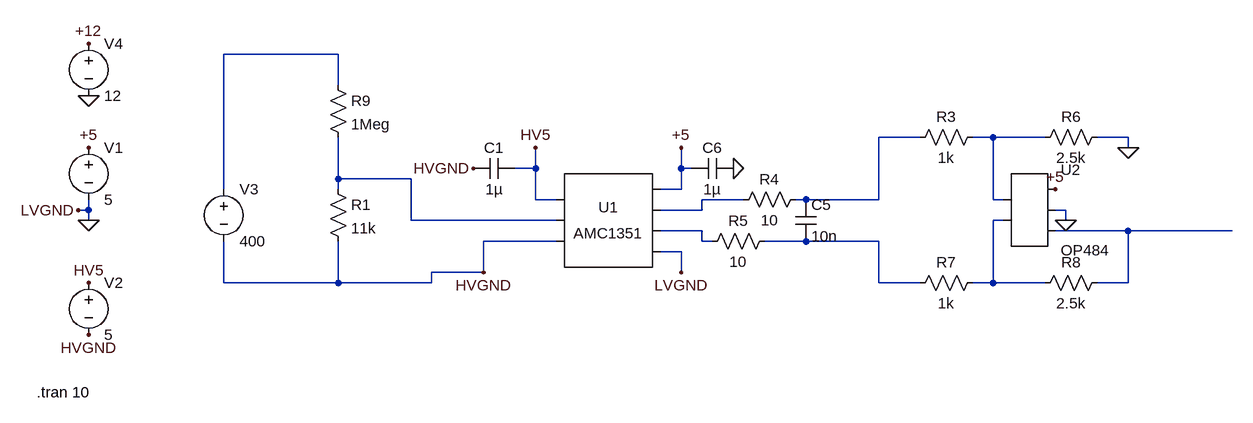
[diagram p0: schematic AMC1350Test.asc]
AMC1350Test.asc, the LTspice schematic file:
Version 4
SHEET 1 1220 680
WIRE -160 -80 -336 -80
WIRE -160 -32 -160 -80
WIRE 736 48 672 48
WIRE 848 48 816 48
WIRE 928 48 848 48
WIRE 1056 48 1008 48
WIRE 1056 64 1056 48
WIRE 144 96 144 64
WIRE 144 96 112 96
WIRE 368 96 368 64
WIRE 384 96 368 96
WIRE -160 112 -160 48
WIRE -48 112 -160 112
WIRE -336 128 -336 -80
WIRE -160 128 -160 112
WIRE 368 128 368 96
WIRE 368 128 336 128
WIRE 144 144 144 96
WIRE 176 144 144 144
WIRE 464 144 400 144
WIRE 560 144 544 144
WIRE 672 144 672 48
WIRE 672 144 560 144
WIRE 848 144 848 48
WIRE 864 144 848 144
WIRE -544 160 -544 144
WIRE -544 160 -560 160
WIRE 400 160 400 144
WIRE 400 160 336 160
WIRE 960 160 944 160
WIRE -544 176 -544 160
WIRE -48 176 -48 112
WIRE 176 176 -48 176
WIRE 864 176 848 176
WIRE 960 176 960 160
WIRE 400 192 336 192
WIRE 1056 192 944 192
WIRE 1216 192 1056 192
WIRE 176 208 64 208
WIRE 400 208 400 192
WIRE 416 208 400 208
WIRE 560 208 496 208
WIRE 672 208 560 208
WIRE 368 224 336 224
WIRE 64 256 64 208
WIRE 64 256 -16 256
WIRE 368 256 368 224
WIRE -336 272 -336 208
WIRE -160 272 -160 208
WIRE -160 272 -336 272
WIRE -16 272 -16 256
WIRE -16 272 -160 272
WIRE 672 272 672 208
WIRE 736 272 672 272
WIRE 848 272 848 176
WIRE 848 272 816 272
WIRE 928 272 848 272
WIRE 1056 272 1056 192
WIRE 1056 272 1008 272
FLAG 368 64 +5
FLAG 144 64 HV5
FLAG 368 256 LVGND
FLAG 64 256 HVGND
FLAG -544 176 0
FLAG -560 160 LVGND
FLAG -544 352 HVGND
FLAG -544 272 HV5
FLAG -544 64 +5
FLAG 448 96 0
FLAG 48 96 HVGND
FLAG 1056 64 0
FLAG -544 -16 0
FLAG -544 -96 +12
FLAG 960 176 0
FLAG 944 128 +5
SYMBOL cap 112 80 R90
WINDOW 0 0 32 VBottom 2
WINDOW 3 32 32 VTop 2
SYMATTR InstName C1
SYMATTR Value 1µ
SYMBOL res -176 112 R0
SYMATTR InstName R1
SYMATTR Value 11k
SYMBOL cap 544 144 R0
SYMATTR InstName C5
SYMATTR Value 10n
SYMBOL res 512 192 R90
WINDOW 0 0 56 VBottom 2
WINDOW 3 32 56 VTop 2
SYMATTR InstName R5
SYMATTR Value 10
SYMBOL res 560 128 R90
WINDOW 0 0 56 VBottom 2
WINDOW 3 32 56 VTop 2
SYMATTR InstName R4
SYMATTR Value 10
SYMBOL cap 448 80 R90
WINDOW 0 0 32 VBottom 2
WINDOW 3 32 32 VTop 2
SYMATTR InstName C6
SYMATTR Value 1µ
SYMBOL voltage -544 48 R0
WINDOW 123 24 114 Left 2
WINDOW 39 0 0 Left 0
SYMATTR InstName V1
SYMATTR Value 5
SYMBOL voltage -544 256 R0
WINDOW 123 24 114 Left 2
WINDOW 39 0 0 Left 0
SYMATTR InstName V2
SYMATTR Value 5
SYMBOL voltage -336 112 R0
WINDOW 123 0 0 Left 0
WINDOW 39 0 0 Left 0
SYMATTR InstName V3
SYMATTR Value 400
SYMBOL AutoGenerated\\AMC1351 256 176 R0
SYMATTR InstName U1
SYMBOL res 832 32 R90
WINDOW 0 0 56 VBottom 2
WINDOW 3 32 56 VTop 2
SYMATTR InstName R3
SYMATTR Value 1k
SYMBOL res 1024 32 R90
WINDOW 0 0 56 VBottom 2
WINDOW 3 32 56 VTop 2
SYMATTR InstName R6
SYMATTR Value 2.5k
SYMBOL res 832 256 R90
WINDOW 0 0 56 VBottom 2
WINDOW 3 32 56 VTop 2
SYMATTR InstName R7
SYMATTR Value 1k
SYMBOL res 1024 256 R90
WINDOW 0 0 56 VBottom 2
WINDOW 3 32 56 VTop 2
SYMATTR InstName R8
SYMATTR Value 2.5k
SYMBOL voltage -544 -112 R0
WINDOW 123 24 114 Left 2
WINDOW 39 0 0 Left 0
SYMATTR InstName V4
SYMATTR Value 12
SYMBOL res -176 -48 R0
SYMATTR InstName R9
SYMATTR Value 1Meg
SYMBOL AutoGenerated\\OP484 896 160 R0
SYMATTR InstName U2
TEXT -624 440 Left 2 !.tran 10

The netlist it stands for:
* AMC1350Test.asc
C1 HV5 HVGND 1µ
R1 N004 HVGND 11k
C5 N002 N009 10n
R5 N009 N007 10
R4 N002 N005 10
C6 0 +5 1µ
V1 +5 0 5
V2 HV5 HVGND 5
V3 N001 HVGND 400
* U1: AMC1351 (symbol AutoGenerated\AMC1351 not available, pins judged from their places): pin1=HV5 pin2=N004 pin3=HVGND pin4=+5 pin5=N005 pin6=N007 pin7=0
R3 N003 N002 1k
R6 0 N003 2.5k
R7 N006 N009 1k
R8 N008 N006 2.5k
V4 +12 0 12
R9 N001 N004 1Meg
* U2: OP484 (symbol AutoGenerated\OP484 not available, pins judged from their places): pin1=N003 pin2=N006 pin3=+5 pin4=0 pin5=N008
.tran 10
.backanno
.end